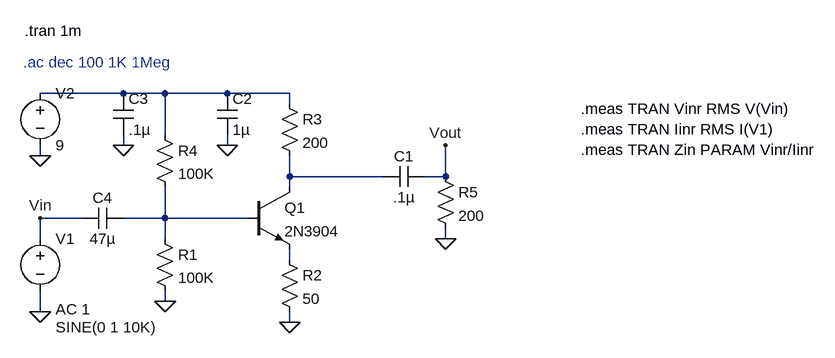
[diagram p0: schematic 2N3904 Input Impedance.asc]
2N3904 Input Impedance.asc, the LTspice schematic file:
Version 4
SHEET 1 1588 1060
WIRE 112 -16 -16 -16
WIRE 176 -16 112 -16
WIRE 272 -16 176 -16
WIRE 368 -16 272 -16
WIRE 368 0 368 -16
WIRE 176 48 176 -16
WIRE 112 64 112 48
WIRE 272 64 272 48
WIRE -16 80 -16 64
WIRE 368 112 368 80
WIRE 512 112 368 112
WIRE 608 112 608 64
WIRE 608 112 576 112
WIRE 368 128 368 112
WIRE 48 176 -16 176
WIRE 176 176 176 128
WIRE 176 176 112 176
WIRE 304 176 176 176
WIRE -16 208 -16 176
WIRE 176 208 176 176
WIRE 608 208 608 192
WIRE 368 240 368 224
WIRE 176 304 176 288
WIRE -16 320 -16 288
WIRE 368 336 368 320
FLAG 176 304 0
FLAG -16 320 0
FLAG 368 336 0
FLAG 608 208 0
FLAG -16 80 0
FLAG 272 64 0
FLAG 112 64 0
FLAG -16 176 Vin
FLAG 608 64 Vout
SYMBOL voltage -16 192 R0
WINDOW 3 24 152 Left 2
WINDOW 123 24 124 Left 2
WINDOW 39 0 0 Left 0
SYMATTR InstName V1
SYMATTR Value SINE(0 1 10K)
SYMATTR Value2 AC 1
SYMBOL voltage -16 -32 R0
WINDOW 123 0 0 Left 0
WINDOW 39 0 0 Left 0
SYMATTR InstName V2
SYMATTR Value 9
SYMBOL npn 304 128 R0
SYMATTR InstName Q1
SYMATTR Value 2N3904
SYMBOL res 160 192 R0
SYMATTR InstName R1
SYMATTR Value 100K
SYMBOL res 352 224 R0
SYMATTR InstName R2
SYMATTR Value 50
SYMBOL res 160 32 R0
SYMATTR InstName R4
SYMATTR Value 100K
SYMBOL res 592 96 R0
SYMATTR InstName R5
SYMATTR Value 200
SYMBOL cap 576 96 R90
WINDOW 0 0 32 VBottom 2
WINDOW 3 32 32 VTop 2
SYMATTR InstName C1
SYMATTR Value .1µ
SYMBOL cap 256 -16 R0
SYMATTR InstName C2
SYMATTR Value 1µ
SYMBOL cap 96 -16 R0
SYMATTR InstName C3
SYMATTR Value .1µ
SYMBOL cap 112 160 R90
WINDOW 0 0 32 VBottom 2
WINDOW 3 32 32 VTop 2
SYMATTR InstName C4
SYMATTR Value 47µ
SYMBOL res 352 -16 R0
SYMATTR InstName R3
SYMATTR Value 200
TEXT -42 -64 Left 2 ;.ac dec 100 1K 1Meg
TEXT 816 8 Left 2 !.meas TRAN Vinr RMS V(Vin)\n.meas TRAN Iinr RMS I(V1)\n.meas TRAN Zin PARAM Vinr/Iinr
TEXT -40 -112 Left 2 !.tran 1m

The netlist it stands for:
* 2N3904 Input Impedance.asc
V1 Vin 0 SINE(0 1 10K) AC 1
V2 N001 0 9
Q1 N002 N003 N004 0 2N3904
R1 N003 0 100K
R2 N004 0 50
R4 N001 N003 100K
R5 Vout 0 200
C1 Vout N002 .1µ
C2 N001 0 1µ
C3 N001 0 .1µ
C4 N003 Vin 47µ
R3 N001 N002 200
.model NPN NPN
.model PNP PNP
.lib standard.bjt
* .ac dec 100 1K 1Meg
.meas TRAN Vinr RMS V(Vin)
.meas TRAN Iinr RMS I(V1)
.meas TRAN Zin PARAM Vinr/Iinr
.tran 1m
.backanno
.end